# Altium schematic sheet 04.RV1126B_Core_Board.SchDoc
size A3; CheckedBy: YPC; DocumentNumber: 4; Revision: V1.00; SheetNumber: 04; SheetTotal: 18; SheetName: SheetName; SheetDescribe: SheetDescribe; Designer: JOW; DesignDate: 2025-04-25; CheckedData: 2025-04-25
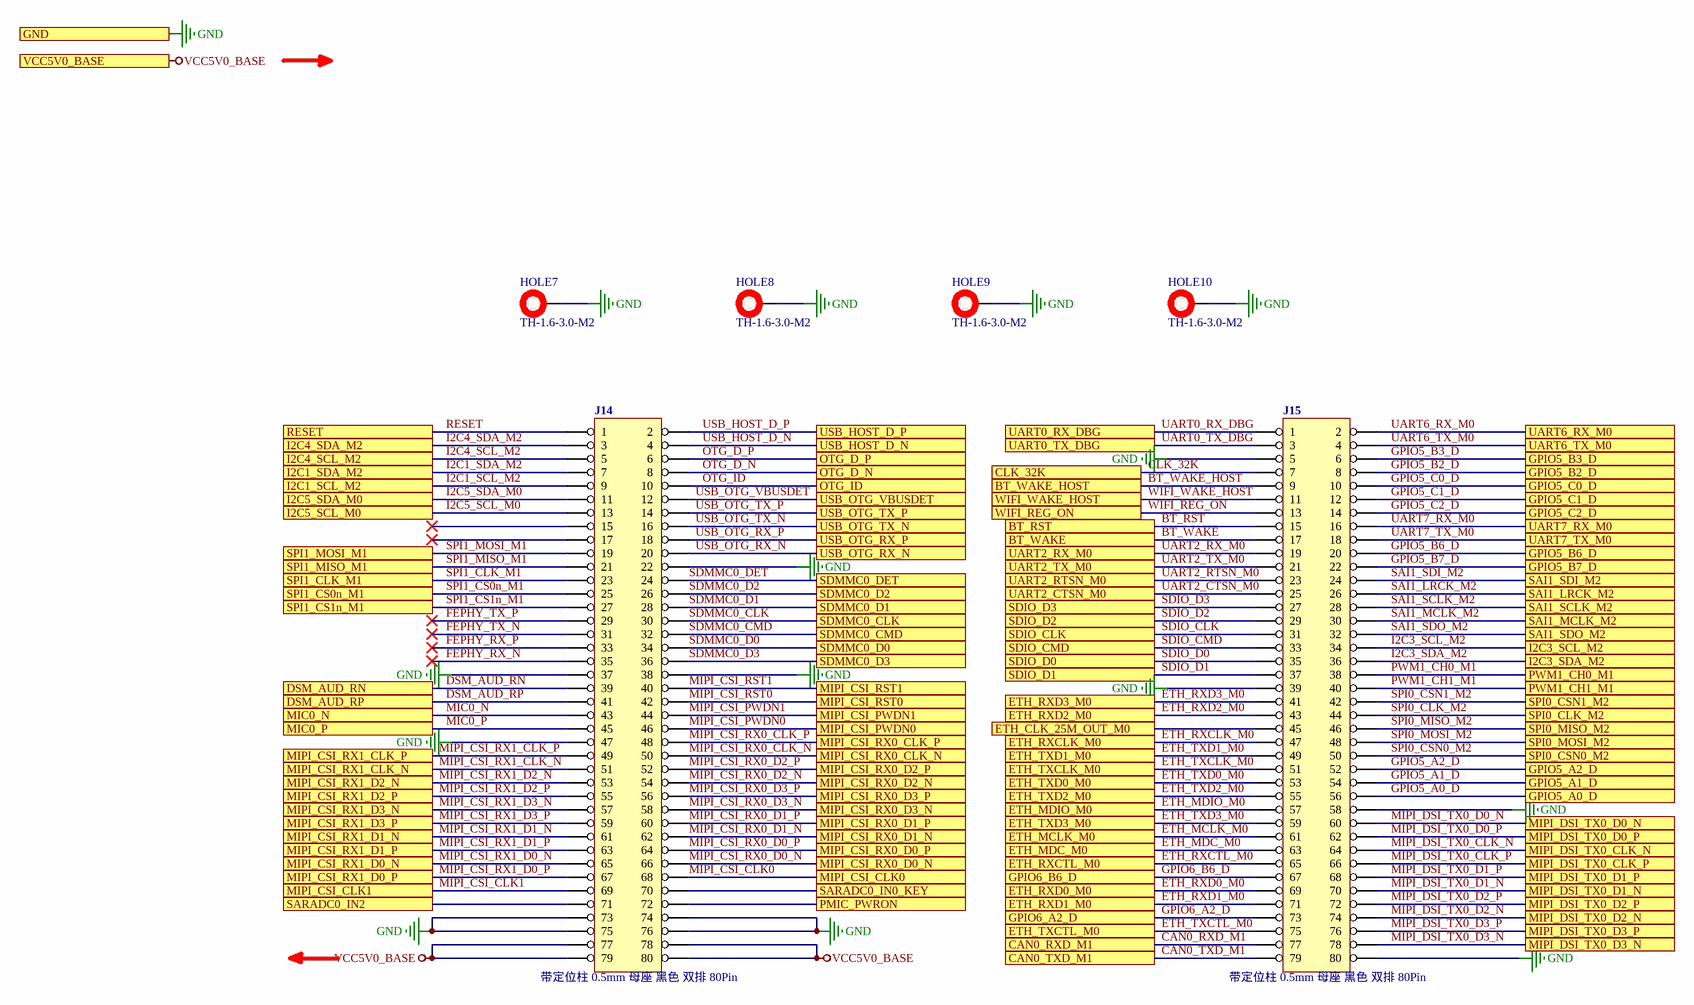
[diagram p0: 04.RV1126B_Core_Board.SchDoc]

## Parts
HOLE7  TH-1.6-3.0-M2  [TH-1.6-3.0-M2]
HOLE8  TH-1.6-3.0-M2  [TH-1.6-3.0-M2]
HOLE9  TH-1.6-3.0-M2  [TH-1.6-3.0-M2]
HOLE10  TH-1.6-3.0-M2  [TH-1.6-3.0-M2]
J14  描述: 带定位柱 0.5mm 母座 黑色 双排 80Pin  [CONN-SMD_80P-P0.50_DF12NA-3.0-80DP-0.5V]  (hidden comment: DF12NA(3.0)-80DP-0.5V(51))
J15  描述: 带定位柱 0.5mm 母座 黑色 双排 80Pin  [CONN-SMD_80P-P0.50_DF12NA-3.0-80DP-0.5V]  (hidden comment: DF12NA(3.0)-80DP-0.5V(51))

## Ports
BT_RST, BT_WAKE, BT_WAKE_HOST, CAN0_RXD_M1, CAN0_TXD_M1, CLK_32K, DSM_AUD_RN, DSM_AUD_RP, ETH_CLK_25M_OUT_M0, ETH_MCLK_M0, ETH_MDC_M0, ETH_MDIO_M0, ETH_RXCLK_M0, ETH_RXCTL_M0, ETH_RXD0_M0, ETH_RXD1_M0, ETH_RXD2_M0, ETH_RXD3_M0, ETH_TXCLK_M0, ETH_TXCTL_M0, ETH_TXD0_M0, ETH_TXD1_M0, ETH_TXD2_M0, ETH_TXD3_M0, GND, GPIO5_A0_D, GPIO5_A1_D, GPIO5_A2_D, GPIO5_B2_D, GPIO5_B3_D, GPIO5_B6_D, GPIO5_B7_D, GPIO5_C0_D, GPIO5_C1_D, GPIO5_C2_D, GPIO6_A2_D, GPIO6_B6_D, I2C1_SCL_M2, I2C1_SDA_M2, I2C3_SCL_M2, I2C3_SDA_M2, I2C4_SCL_M2, I2C4_SDA_M2, I2C5_SCL_M0, I2C5_SDA_M0, MIC0_N, MIC0_P, MIPI_CSI_CLK0, MIPI_CSI_CLK1, MIPI_CSI_PWDN0, MIPI_CSI_PWDN1, MIPI_CSI_RST0, MIPI_CSI_RST1, MIPI_CSI_RX0_CLK_N, MIPI_CSI_RX0_CLK_P, MIPI_CSI_RX0_D0_N, MIPI_CSI_RX0_D0_P, MIPI_CSI_RX0_D1_N, MIPI_CSI_RX0_D1_P, MIPI_CSI_RX0_D2_N, MIPI_CSI_RX0_D2_P, MIPI_CSI_RX0_D3_N, MIPI_CSI_RX0_D3_P, MIPI_CSI_RX1_CLK_N, MIPI_CSI_RX1_CLK_P, MIPI_CSI_RX1_D0_N, MIPI_CSI_RX1_D0_P, MIPI_CSI_RX1_D1_N, MIPI_CSI_RX1_D1_P, MIPI_CSI_RX1_D2_N, MIPI_CSI_RX1_D2_P, MIPI_CSI_RX1_D3_N, MIPI_CSI_RX1_D3_P, MIPI_DSI_TX0_CLK_N, MIPI_DSI_TX0_CLK_P, MIPI_DSI_TX0_D0_N, MIPI_DSI_TX0_D0_P, MIPI_DSI_TX0_D1_N, MIPI_DSI_TX0_D1_P, MIPI_DSI_TX0_D2_N, MIPI_DSI_TX0_D2_P, MIPI_DSI_TX0_D3_N, MIPI_DSI_TX0_D3_P, OTG_D_N, OTG_D_P, OTG_ID, PMIC_PWRON, PWM1_CH0_M1, PWM1_CH1_M1, RESET, SAI1_LRCK_M2, SAI1_MCLK_M2, SAI1_SCLK_M2, SAI1_SDI_M2, SAI1_SDO_M2, SARADC0_IN0_KEY, SARADC0_IN2, SDIO_CLK, SDIO_CMD, SDIO_D0, SDIO_D1, SDIO_D2, SDIO_D3, SDMMC0_CLK, SDMMC0_CMD, SDMMC0_D0, SDMMC0_D1, SDMMC0_D2, SDMMC0_D3, SDMMC0_DET, SPI0_CLK_M2, SPI0_CSN0_M2, SPI0_CSN1_M2, SPI0_MISO_M2, SPI0_MOSI_M2, SPI1_CLK_M1, SPI1_CS0n_M1, SPI1_CS1n_M1, SPI1_MISO_M1, SPI1_MOSI_M1, UART0_RX_DBG, UART0_TX_DBG, UART2_CTSN_M0, UART2_RTSN_M0, UART2_RX_M0, UART2_TX_M0, UART6_RX_M0, UART6_TX_M0, UART7_RX_M0, UART7_TX_M0, USB_HOST_D_N, USB_HOST_D_P, USB_OTG_RX_N, USB_OTG_RX_P, USB_OTG_TX_N, USB_OTG_TX_P, USB_OTG_VBUSDET, VCC5V0_BASE, WIFI_REG_ON, WIFI_WAKE_HOST

## Nets
GND: HOLE7.1 HOLE8.1 HOLE9.1 HOLE10.1 J14.22 J14.37 J14.38 J14.47 J14.73 J14.74 J14.75 J14.76 J15.5 J15.39 J15.58 J15.80 ; port GND
VCC5V0_BASE: J14.77 J14.78 J14.79 J14.80 ; port VCC5V0_BASE
BT_RST: J15.15 ; port BT_RST
BT_WAKE: J15.17 ; port BT_WAKE
BT_WAKE_HOST: J15.9 ; port BT_WAKE_HOST
CAN0_RXD_M1: J15.77 ; port CAN0_RXD_M1
CAN0_TXD_M1: J15.79 ; port CAN0_TXD_M1
CLK_32K: J15.7 ; port CLK_32K
DSM_AUD_RN: J14.39 ; port DSM_AUD_RN
DSM_AUD_RP: J14.41 ; port DSM_AUD_RP
ETH_CLK_25M_OUT_M0: J15.45 ; port ETH_CLK_25M_OUT_M0
ETH_MCLK_M0: J15.61 ; port ETH_MCLK_M0
ETH_MDC_M0: J15.63 ; port ETH_MDC_M0
ETH_MDIO_M0: J15.57 ; port ETH_MDIO_M0
ETH_RXCLK_M0: J15.47 ; port ETH_RXCLK_M0
ETH_RXCTL_M0: J15.65 ; port ETH_RXCTL_M0
ETH_RXD0_M0: J15.69 ; port ETH_RXD0_M0
ETH_RXD1_M0: J15.71 ; port ETH_RXD1_M0
ETH_RXD2_M0: J15.43 ; port ETH_RXD2_M0
ETH_RXD3_M0: J15.41 ; port ETH_RXD3_M0
ETH_TXCLK_M0: J15.51 ; port ETH_TXCLK_M0
ETH_TXCTL_M0: J15.75 ; port ETH_TXCTL_M0
ETH_TXD0_M0: J15.53 ; port ETH_TXD0_M0
ETH_TXD1_M0: J15.49 ; port ETH_TXD1_M0
ETH_TXD2_M0: J15.55 ; port ETH_TXD2_M0
ETH_TXD3_M0: J15.59 ; port ETH_TXD3_M0
FEPHY_RX_N: J14.35
FEPHY_RX_P: J14.33
FEPHY_TX_N: J14.31
FEPHY_TX_P: J14.29
GPIO5_A0_D: J15.56 ; port GPIO5_A0_D
GPIO5_A1_D: J15.54 ; port GPIO5_A1_D
GPIO5_A2_D: J15.52 ; port GPIO5_A2_D
GPIO5_B2_D: J15.8 ; port GPIO5_B2_D
GPIO5_B3_D: J15.6 ; port GPIO5_B3_D
GPIO5_B6_D: J15.20 ; port GPIO5_B6_D
GPIO5_B7_D: J15.22 ; port GPIO5_B7_D
GPIO5_C0_D: J15.10 ; port GPIO5_C0_D
GPIO5_C1_D: J15.12 ; port GPIO5_C1_D
GPIO5_C2_D: J15.14 ; port GPIO5_C2_D
GPIO6_A2_D: J15.73 ; port GPIO6_A2_D
GPIO6_B6_D: J15.67 ; port GPIO6_B6_D
I2C1_SCL_M2: J14.9 ; port I2C1_SCL_M2
I2C1_SDA_M2: J14.7 ; port I2C1_SDA_M2
I2C3_SCL_M2: J15.34 ; port I2C3_SCL_M2
I2C3_SDA_M2: J15.36 ; port I2C3_SDA_M2
I2C4_SCL_M2: J14.5 ; port I2C4_SCL_M2
I2C4_SDA_M2: J14.3 ; port I2C4_SDA_M2
I2C5_SCL_M0: J14.13 ; port I2C5_SCL_M0
I2C5_SDA_M0: J14.11 ; port I2C5_SDA_M0
MIC0_N: J14.43 ; port MIC0_N
MIC0_P: J14.45 ; port MIC0_P
MIPI_CSI_CLK0: J14.68 ; port MIPI_CSI_CLK0
MIPI_CSI_CLK1: J14.69 ; port MIPI_CSI_CLK1
MIPI_CSI_PWDN0: J14.46 ; port MIPI_CSI_PWDN0
MIPI_CSI_PWDN1: J14.44 ; port MIPI_CSI_PWDN1
MIPI_CSI_RST0: J14.42 ; port MIPI_CSI_RST0
MIPI_CSI_RST1: J14.40 ; port MIPI_CSI_RST1
MIPI_CSI_RX0_CLK_N: J14.50 ; port MIPI_CSI_RX0_CLK_N
MIPI_CSI_RX0_CLK_P: J14.48 ; port MIPI_CSI_RX0_CLK_P
MIPI_CSI_RX0_D0_N: J14.66 ; port MIPI_CSI_RX0_D0_N
MIPI_CSI_RX0_D0_P: J14.64 ; port MIPI_CSI_RX0_D0_P
MIPI_CSI_RX0_D1_N: J14.62 ; port MIPI_CSI_RX0_D1_N
MIPI_CSI_RX0_D1_P: J14.60 ; port MIPI_CSI_RX0_D1_P
MIPI_CSI_RX0_D2_N: J14.54 ; port MIPI_CSI_RX0_D2_N
MIPI_CSI_RX0_D2_P: J14.52 ; port MIPI_CSI_RX0_D2_P
MIPI_CSI_RX0_D3_N: J14.58 ; port MIPI_CSI_RX0_D3_N
MIPI_CSI_RX0_D3_P: J14.56 ; port MIPI_CSI_RX0_D3_P
MIPI_CSI_RX1_CLK_N: J14.51 ; port MIPI_CSI_RX1_CLK_N
MIPI_CSI_RX1_CLK_P: J14.49 ; port MIPI_CSI_RX1_CLK_P
MIPI_CSI_RX1_D0_N: J14.65 ; port MIPI_CSI_RX1_D0_N
MIPI_CSI_RX1_D0_P: J14.67 ; port MIPI_CSI_RX1_D0_P
MIPI_CSI_RX1_D1_N: J14.61 ; port MIPI_CSI_RX1_D1_N
MIPI_CSI_RX1_D1_P: J14.63 ; port MIPI_CSI_RX1_D1_P
MIPI_CSI_RX1_D2_N: J14.53 ; port MIPI_CSI_RX1_D2_N
MIPI_CSI_RX1_D2_P: J14.55 ; port MIPI_CSI_RX1_D2_P
MIPI_CSI_RX1_D3_N: J14.57 ; port MIPI_CSI_RX1_D3_N
MIPI_CSI_RX1_D3_P: J14.59 ; port MIPI_CSI_RX1_D3_P
MIPI_DSI_TX0_CLK_N: J15.64 ; port MIPI_DSI_TX0_CLK_N
MIPI_DSI_TX0_CLK_P: J15.66 ; port MIPI_DSI_TX0_CLK_P
MIPI_DSI_TX0_D0_N: J15.60 ; port MIPI_DSI_TX0_D0_N
MIPI_DSI_TX0_D0_P: J15.62 ; port MIPI_DSI_TX0_D0_P
MIPI_DSI_TX0_D1_N: J15.70 ; port MIPI_DSI_TX0_D1_N
MIPI_DSI_TX0_D1_P: J15.68 ; port MIPI_DSI_TX0_D1_P
MIPI_DSI_TX0_D2_N: J15.74 ; port MIPI_DSI_TX0_D2_N
MIPI_DSI_TX0_D2_P: J15.72 ; port MIPI_DSI_TX0_D2_P
MIPI_DSI_TX0_D3_N: J15.78 ; port MIPI_DSI_TX0_D3_N
MIPI_DSI_TX0_D3_P: J15.76 ; port MIPI_DSI_TX0_D3_P
OTG_D_N: J14.8 ; port OTG_D_N
OTG_D_P: J14.6 ; port OTG_D_P
OTG_ID: J14.10 ; port OTG_ID
PMIC_PWRON: J14.72 ; port PMIC_PWRON
PWM1_CH0_M1: J15.38 ; port PWM1_CH0_M1
PWM1_CH1_M1: J15.40 ; port PWM1_CH1_M1
RESET: J14.1 ; port RESET
SAI1_LRCK_M2: J15.26 ; port SAI1_LRCK_M2
SAI1_MCLK_M2: J15.30 ; port SAI1_MCLK_M2
SAI1_SCLK_M2: J15.28 ; port SAI1_SCLK_M2
SAI1_SDI_M2: J15.24 ; port SAI1_SDI_M2
SAI1_SDO_M2: J15.32 ; port SAI1_SDO_M2
SARADC0_IN0_KEY: J14.70 ; port SARADC0_IN0_KEY
SARADC0_IN2: J14.71 ; port SARADC0_IN2
SDIO_CLK: J15.31 ; port SDIO_CLK
SDIO_CMD: J15.33 ; port SDIO_CMD
SDIO_D0: J15.35 ; port SDIO_D0
SDIO_D1: J15.37 ; port SDIO_D1
SDIO_D2: J15.29 ; port SDIO_D2
SDIO_D3: J15.27 ; port SDIO_D3
SDMMC0_CLK: J14.30 ; port SDMMC0_CLK
SDMMC0_CMD: J14.32 ; port SDMMC0_CMD
SDMMC0_D0: J14.34 ; port SDMMC0_D0
SDMMC0_D1: J14.28 ; port SDMMC0_D1
SDMMC0_D2: J14.26 ; port SDMMC0_D2
SDMMC0_D3: J14.36 ; port SDMMC0_D3
SDMMC0_DET: J14.24 ; port SDMMC0_DET
SPI0_CLK_M2: J15.44 ; port SPI0_CLK_M2
SPI0_CSN0_M2: J15.50 ; port SPI0_CSN0_M2
SPI0_CSN1_M2: J15.42 ; port SPI0_CSN1_M2
SPI0_MISO_M2: J15.46 ; port SPI0_MISO_M2
SPI0_MOSI_M2: J15.48 ; port SPI0_MOSI_M2
SPI1_CLK_M1: J14.23 ; port SPI1_CLK_M1
SPI1_CS0n_M1: J14.25 ; port SPI1_CS0n_M1
SPI1_CS1n_M1: J14.27 ; port SPI1_CS1n_M1
SPI1_MISO_M1: J14.21 ; port SPI1_MISO_M1
SPI1_MOSI_M1: J14.19 ; port SPI1_MOSI_M1
UART0_RX_DBG: J15.1 ; port UART0_RX_DBG
UART0_TX_DBG: J15.3 ; port UART0_TX_DBG
UART2_CTSN_M0: J15.25 ; port UART2_CTSN_M0
UART2_RTSN_M0: J15.23 ; port UART2_RTSN_M0
UART2_RX_M0: J15.19 ; port UART2_RX_M0
UART2_TX_M0: J15.21 ; port UART2_TX_M0
UART6_RX_M0: J15.2 ; port UART6_RX_M0
UART6_TX_M0: J15.4 ; port UART6_TX_M0
UART7_RX_M0: J15.16 ; port UART7_RX_M0
UART7_TX_M0: J15.18 ; port UART7_TX_M0
USB_HOST_D_N: J14.4 ; port USB_HOST_D_N
USB_HOST_D_P: J14.2 ; port USB_HOST_D_P
USB_OTG_RX_N: J14.20 ; port USB_OTG_RX_N
USB_OTG_RX_P: J14.18 ; port USB_OTG_RX_P
USB_OTG_TX_N: J14.16 ; port USB_OTG_TX_N
USB_OTG_TX_P: J14.14 ; port USB_OTG_TX_P
USB_OTG_VBUSDET: J14.12 ; port USB_OTG_VBUSDET
WIFI_REG_ON: J15.13 ; port WIFI_REG_ON
WIFI_WAKE_HOST: J15.11 ; port WIFI_WAKE_HOST

Not connected (* = marked no-connect by the designer): J14 15* 17*

## Notes on the sheet
- 产品名称
- 产品型号
- 设计人员
- 设计日期
- 审核人员
- 审核日期
- 图纸名称
- 图纸描述
- 图纸版本
- A3
- 广州灵眸科技有限公司

## Library data of the parts
HOLE7-HOLE10 = 螺柱 TH-1.6-3.0-M2: SPZL000886; 名称: 螺柱; 封装: SMD; 厂商: 雄和远景; 描述: 核心板螺柱 M2.5; 贴片和直插: SMD; SuppliersPartNumber: *; 商品编号: SPZL000886; 工作温度: *; 型号: TH-1.6-3.0-M2
J14 J15 = DF12NA(3.0)-80DP-0.5V(51): SPZL000772; 名称: 板对板连接器; 封装: SMD; 厂商: HRS(广濑); 贴片和直插: SMD; SuppliersPartNumber: *; 型号: DF12NA(3.0)-80DP-0.5V(51); 商品编号: SPZL000772; 工作温度: *